# EAGLE design untitled (EAGLE 5.10)
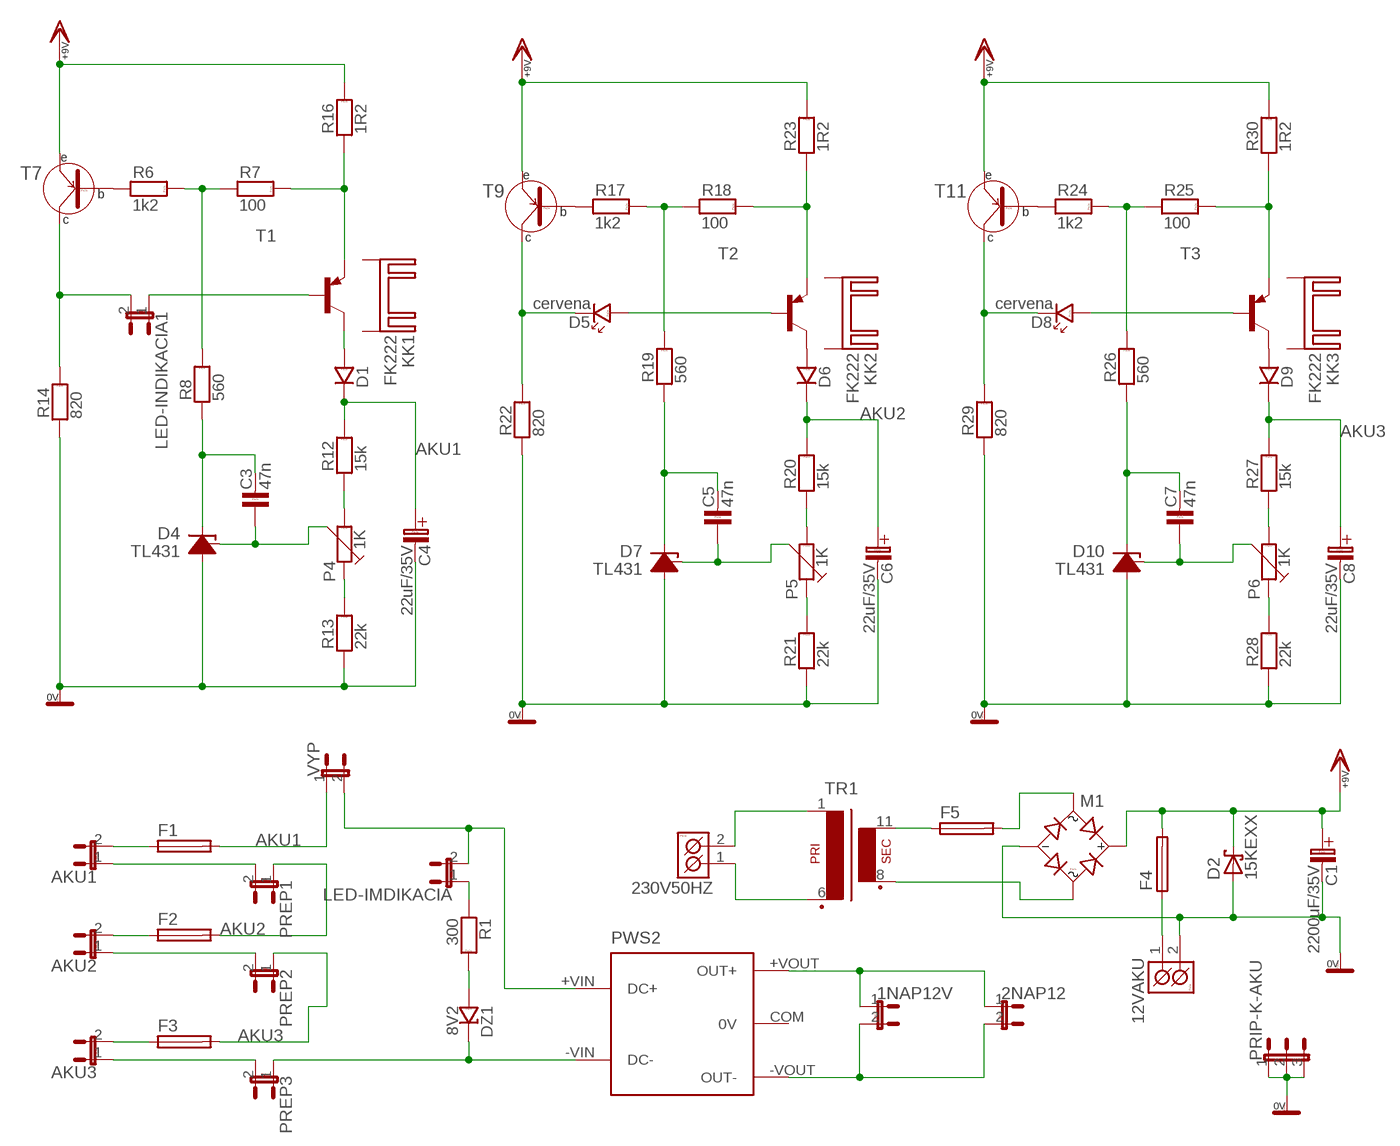
[diagram p0: schematic, sheet 1]

## Parts
1NAP12V  S1G2_JUMP  [S1G2_JUM]
2NAP12  S1G2_JUMP  [S1G2_JUM]
12VAKU  ARK500/2  [ARK500/2]
230V50HZ  ARK500/2  [ARK500/2]
AKU1  S1G2_JUMP  [S1G2_JUM]
AKU2  S1G2_JUMP  [S1G2_JUM]
AKU3  S1G2_JUMP  [S1G2_JUM]
C1  2200uF/35V  C-EL_7,5+  [C-EL7,5+]
C3  47n  C-5  [C-5]
C4  22uF/35V  C-EL_3,5  [C-EL_3,5]
C5  47n  C-5  [C-5]
C6  22uF/35V  C-EL_3,5  [C-EL_3,5]
C7  47n  C-5  [C-5]
C8  22uF/35V  C-EL_3,5  [C-EL_3,5]
D1  1N4148  [D-7,5]
D2  15KEXX  [CB429-17]
D4  TL431  [TO92D-]
D5  cervena  LED_5  [LED_5]
D6  1N4148  [D-7,5]
D7  TL431  [TO92D-]
D8  cervena  LED_5  [LED_5]
D9  1N4148  [D-7,5]
D10  TL431  [TO92D-]
DZ1  8V2  BZX85V  [D-7,5]
F1  SH22,5A  [SH22,5A]
F2  SH22,5A  [SH22,5A]
F3  SH22,5A  [SH22,5A]
F4  SH22,5A  [SH22,5A]
F5  SH22,5A  [SH22,5A]
KK1  FK222  [FK222]
KK2  FK222  [FK222]
KK3  FK222  [FK222]
LED-IMDIKACIA  S1G2_JUMP  [S1G2_JUM]
LED-INDIKACIA1  S1G2_JUMP  [S1G2_JUM]
M1  B250C1500  [DM_WOM]
P4  1K  PT-6H_STO  [PT6H]
P5  1K  PT-6H_STO  [PT6H]
P6  1K  PT-6H_STO  [PT6H]
PREP1  S1G2_JUMP  [S1G2_JUM]
PREP2  S1G2_JUMP  [S1G2_JUM]
PREP3  S1G2_JUMP  [S1G2_JUM]
PRIP-K-AKU  S1G3_JUMP  [S1G3_JUM]
PWS2  TAP2422  [TAP2422]
R1  300  R-5  [R-5]
R6  1k2  R-5  [R-5]
R7  100  R-5  [R-5]
R8  560  R-5  [R-5]
R12  15k  R-5  [R-5]
R13  22k  R-5  [R-5]
R14  820  R-5  [R-5]
R16  1R2  R-7,5  [R-7,5]
R17  1k2  R-5  [R-5]
R18  100  R-5  [R-5]
R19  560  R-5  [R-5]
R20  15k  R-5  [R-5]
R21  22k  R-5  [R-5]
R22  820  R-5  [R-5]
R23  1R2  R-5  [R-5]
R24  1k2  R-5  [R-5]
R25  100  R-5  [R-5]
R26  560  R-5  [R-5]
R27  15k  R-5  [R-5]
R28  22k  R-5  [R-5]
R29  820  R-5  [R-5]
R30  1R2  R-5  [R-5]
T1  -PNP-TO220V  [TO220V]
T2  -PNP-TO220V  [TO220V]
T3  -PNP-TO220V  [TO220V]
T7  BC556  [TO-92]
T9  BC556  [TO-92]
T11  BC556  [TO-92]
TR1  EI48-1  [EI48-1]
VYP  S1G2_JUMP  [S1G2_JUM]

## Nets
0V: 12VAKU.2(K2) C1.C-(C_EL-) C4.C-(C_EL-) C6.C-(C_EL-) C8.C-(C_EL-) D2.A D4.2(A) D7.2(A) D10.2(A) M1.- PRIP-K-AKU.1 PRIP-K-AKU.2 PRIP-K-AKU.3 R13.1 R14.1 R21.1 R22.1 R28.1 R29.1
+9V: C1.C+(C_EL+) D2.C F4.2 M1.+ R16.2 R23.2 R30.2 T7.3(E) T9.3(E) T11.3(E)
AKU1: C4.C+(C_EL+) D1.K F1.2 R12.2 VYP.1
AKU2: C6.C+(C_EL+) D6.K F2.2 PREP1.1 R20.2
AKU3: C8.C+(C_EL+) D9.K F3.2 PREP2.1 R27.2
N$1: LED-IMDIKACIA.1 R1.1
N$2: DZ1.A R1.2
N$3: 230V50HZ.2(K2) TR1.1
N$4: D1.A T1.2(C)
N$5: F5.1 TR1.11(S4)
N$6: F5.2 M1.AC1
N$7: LED-IMDIKACIA.2 PWS2.+VIN(DC+) VYP.2
N$8: AKU1.2 F1.1
N$9: 12VAKU.1(K1) F4.1
N$10: AKU1.1 PREP1.2
N$15: M1.AC2 TR1.8(S3)
N$17: AKU2.2 F2.1
N$18: AKU3.1 PREP3.2
N$19: AKU3.2 F3.1
N$20: D6.A T2.2(C)
N$21: D9.A T3.2(C)
N$22: 1NAP12V.1 2NAP12.1 PWS2.+VOUT(OUT+)
N$23: 230V50HZ.1(K1) TR1.6(P2)
N$24: 1NAP12V.2 2NAP12.2 PWS2.-VOUT(OUT-)
N$28: R6.1 T7.2(B)
N$30: R6.2 R7.1 R8.2
N$31: R7.2 R16.1 T1.3(E)
N$33: C3.2 D4.3(K) R8.1
N$34: LED-INDIKACIA1.1 T1.1(B)
N$35: LED-INDIKACIA1.2 R14.2 T7.1(C)
N$37: C3.1 D4.1(J) P4.3
N$39: P4.1 R13.2
N$40: P4.2 R12.1
N$42: R17.1 T9.2(B)
N$44: DZ1.K PREP3.1 PWS2.-VIN(DC-)
N$46: R17.2 R18.1 R19.2
N$47: R18.2 R23.1 T2.3(E)
N$49: C5.2 D7.3(K) R19.1
N$50: D5.A1(A) T2.1(B)
N$51: D5.K1(K) R22.2 T9.1(C)
N$52: C5.1 D7.1(J) P5.3
N$53: P5.1 R21.2
N$54: P5.2 R20.1
N$55: R24.1 T11.2(B)
N$57: R24.2 R25.1 R26.2
N$58: R25.2 R30.1 T3.3(E)
N$60: C7.2 D10.3(K) R26.1
N$61: D8.A1(A) T3.1(B)
N$62: D8.K1(K) R29.2 T11.1(C)
N$63: C7.1 D10.1(J) P6.3
N$64: P6.1 R28.2
N$65: P6.2 R27.1
NON: AKU2.1 PREP2.2
Unconnected: KK1.A2,8(K) KK1.B2,8(K) KK2.A2,8(K) KK2.B2,8(K) KK3.A2,8(K) KK3.B2,8(K) PWS2.COM(0V)

## Library data of the parts
1NAP12V 2NAP12 AKU1-AKU3 LED-IMDIKACIA LED-INDIKACIA1 PREP1-PREP3 VYP = #PaJa_92:S1G2_JUMP
12VAKU 230V50HZ = #PaJa_92:ARK500/2
C1 = #PaJa_92:C-EL_7,5+
C3 C5 C7 = #PaJa_92:C-5
C4 C6 C8 = #PaJa_92:C-EL_3,5
D1 D6 D9 = #PaJa_92:1N4148
D2 = diode:15KEXX: DIODE
D4 D7 D10 = ads4:TL431: TL431 Adjustable Shunt Regulator
D5 D8 = #PaJa_92:LED_5
DZ1 = #PaJa_92:BZX85V???
F1-F5 = fuse:SH22,5A: FUSE HOLDER grid 22,5mm, isolated cap OGN0031 8201, Schurter (Buerklin)
KK1-KK3 = #heatsink:FK222: HEATSINK manufacturer Fischer/distributor Buerklin
M1 = #PaJa_92:B250C1500
P4-P6 = #PaJa_92:PT-6H_STO
PRIP-K-AKU = #PaJa_92:S1G3_JUMP
PWS2 = traco-electronic:TAP2422: Abgekündigt Ersetzt durch TEN 15 Serie,
R1 R6-R8 R12-R14 R17-R30 = #PaJa_92:R-5
R16 = #PaJa_92:R-7,5
T1-T3 = transistor:*-PNP-: PNP Transistror
T7 T9 T11 = #PaJa_92:BC556
TR1 = trafo:EI48-1: TRANSFORMER 1 primary winding, 1 secondary winding ERA

## Board
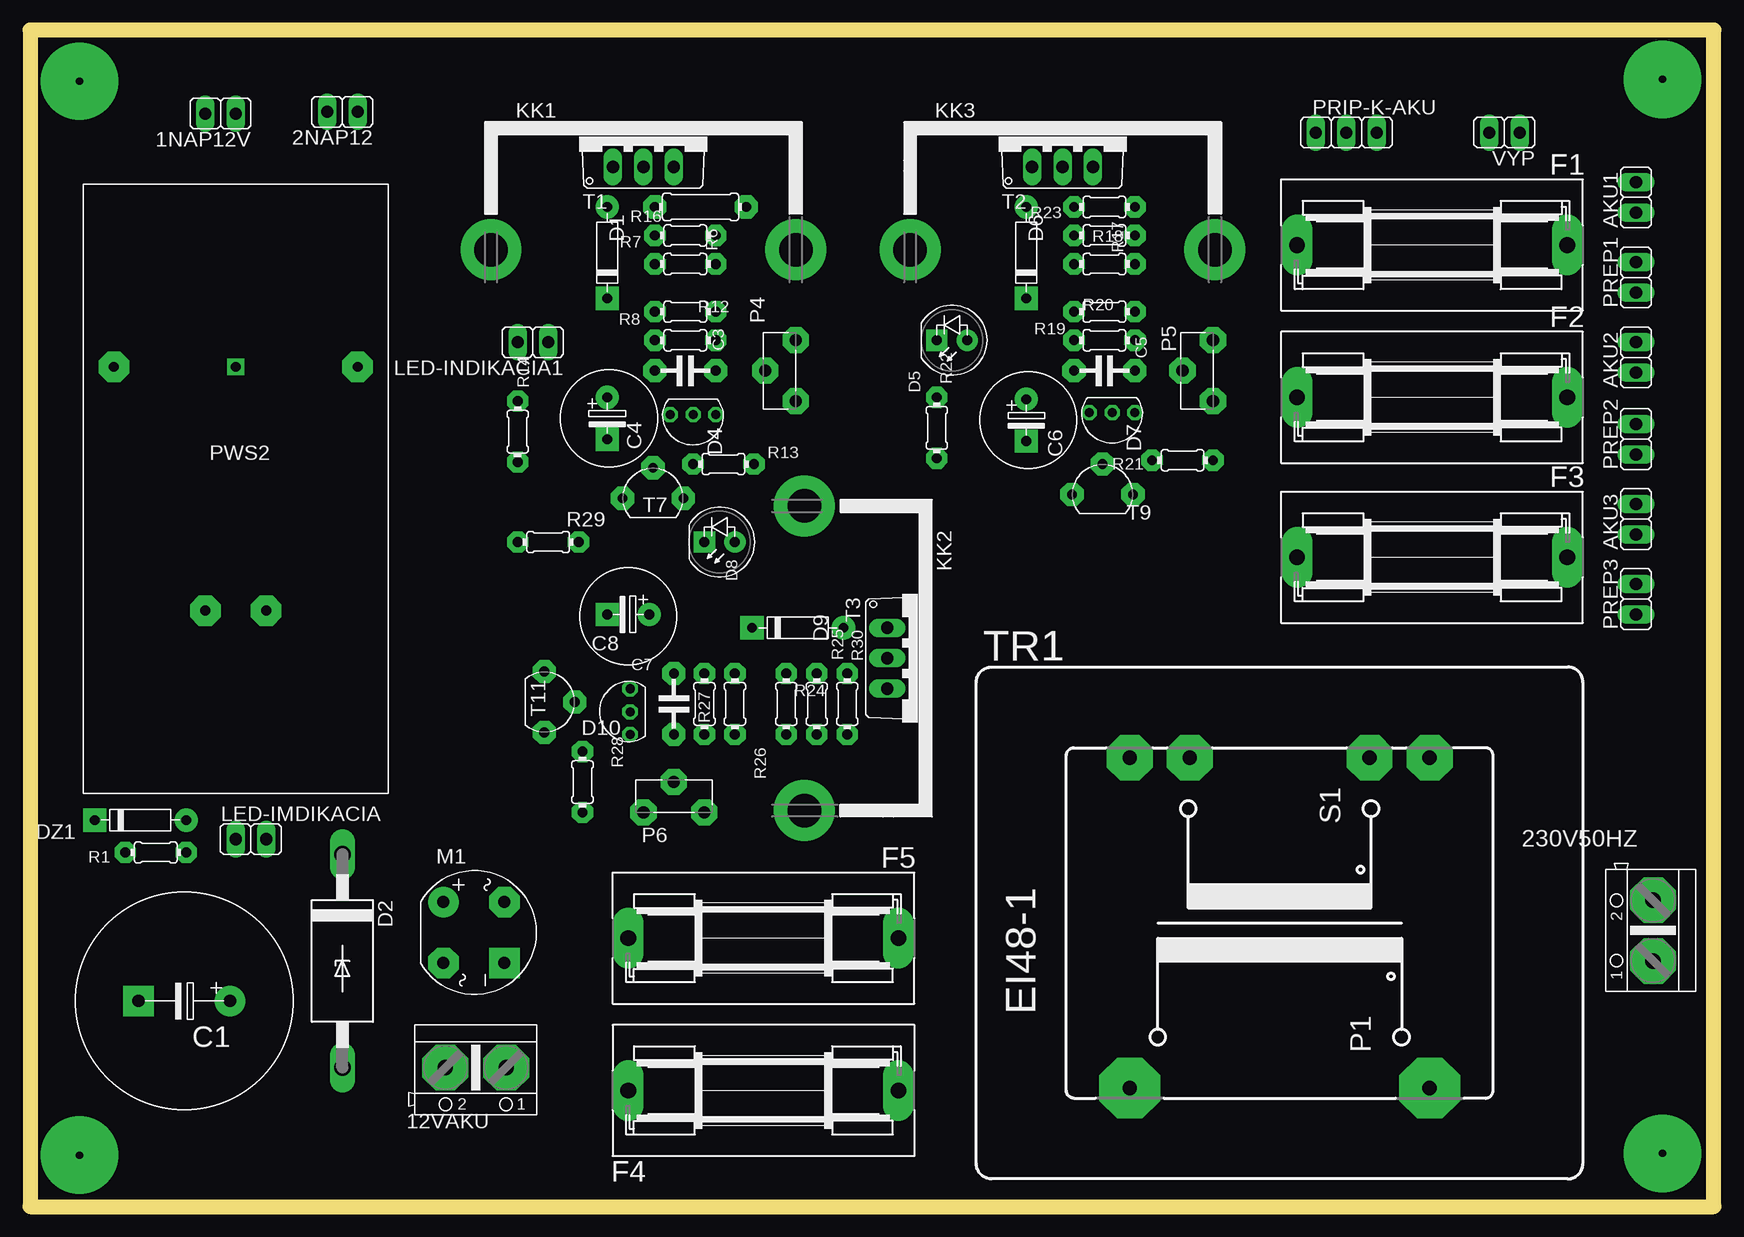
[diagram p1: board, top side]
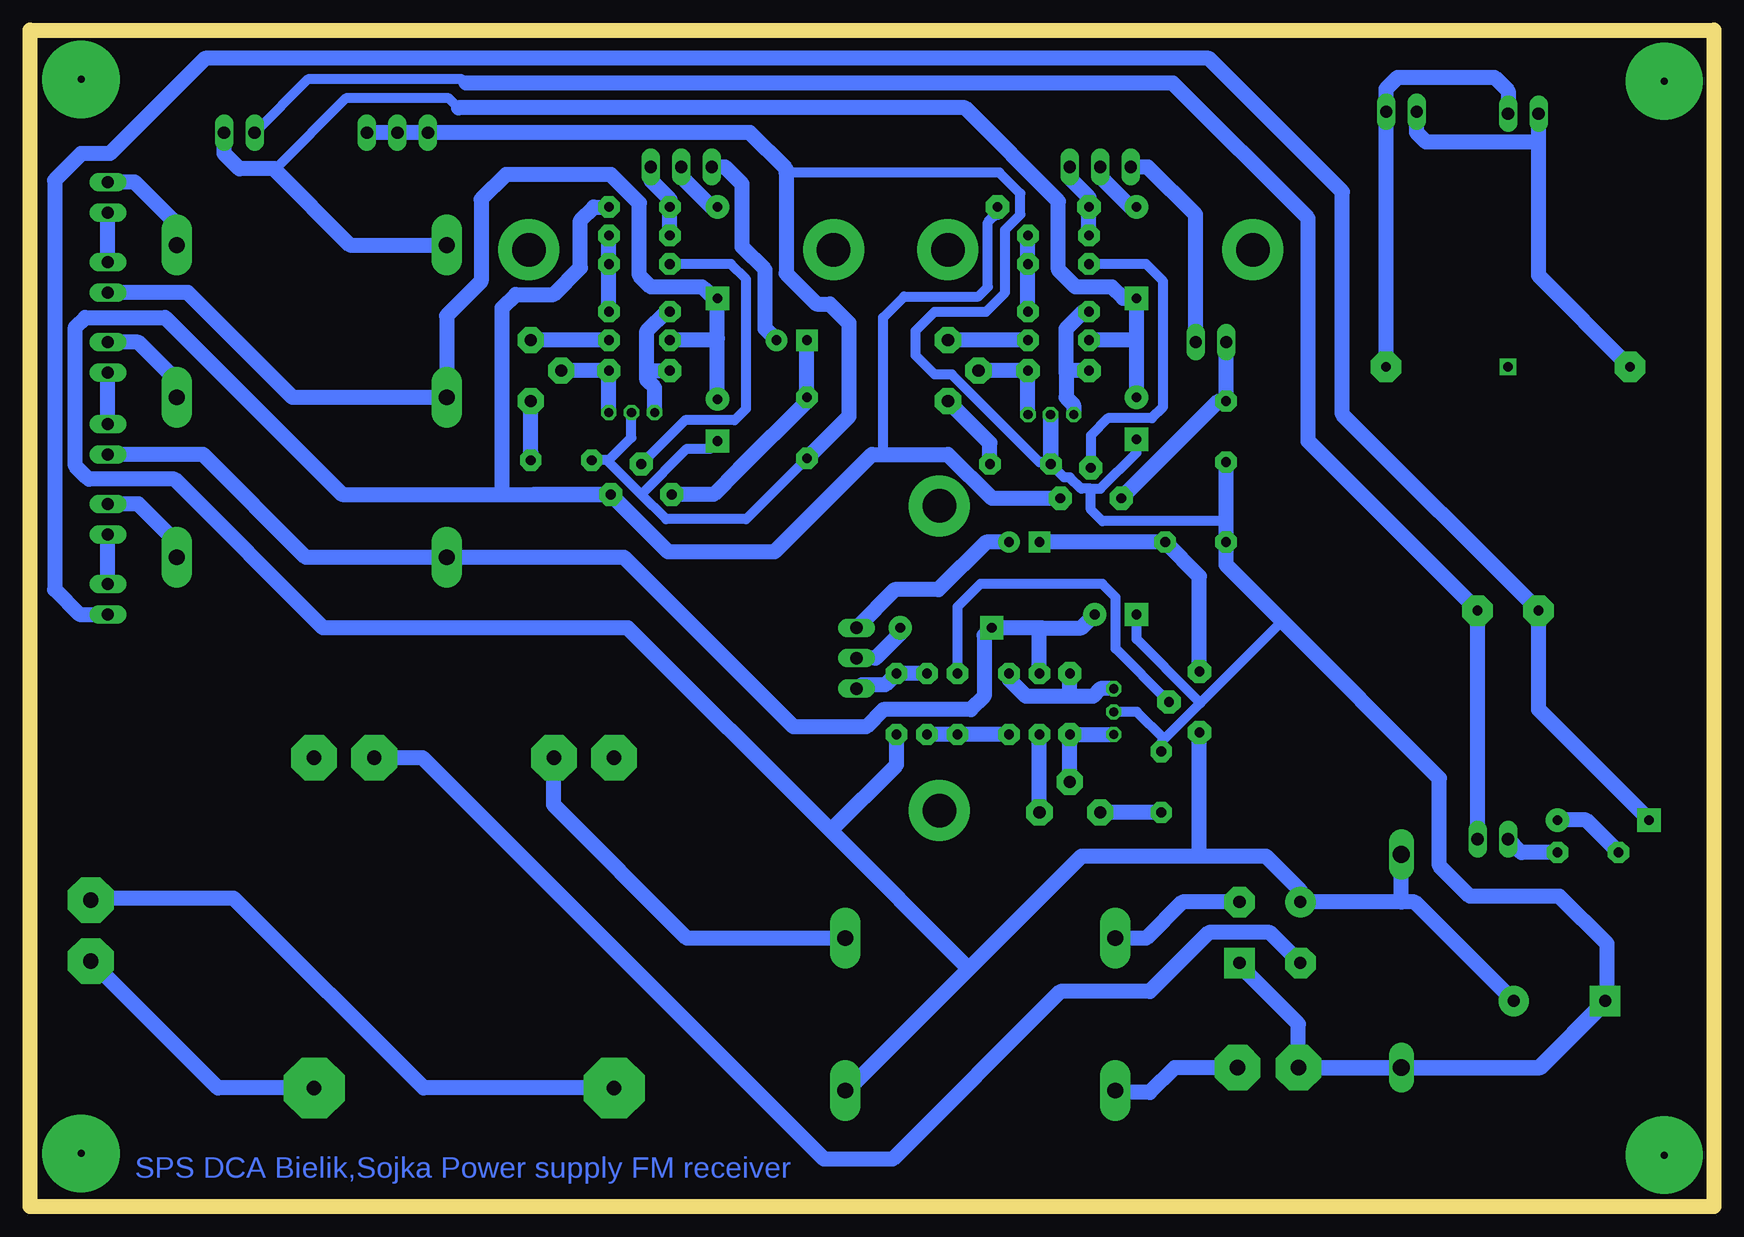
[diagram p2: board, bottom side, seen from below]

Size 140.31 x 98.09 mm. Coordinates in mm from the lower left corner, seen from the top.
Outline: 0,0 140.31,0 140.31,98.09 0,98.09 0,0
Copper layers (1*16): Top 0.035mm / dielectric 1.5mm / Bottom 0.035mm
Design rules "default": minimum track width 10mil, minimum drill 24mil, track to track 8mil, track to pad 8mil, pad to pad 8mil, via to via 8mil, smd to smd 8mil, copper to edge 40mil, drill to drill 8mil, minimum pad ring 10mil, minimum via ring 8mil, stop-mask expansion 4mil, vias tented up to drill 0mil, thermal gap 10mil

### Footprints (pad centres in the part's own frame; a part is rotated, then mirrored left to right if it is on the bottom)
S1G2_JUM = drill 1.016 pad 1.27 long: 1 -1.27,0; 2 1.27,0
ARK500/2 = drill 1.27 pad 3.81 octagon: 1 -2.54,0; 2 2.54,0
C-EL7,5+ = drill 1.016 pad 2.54 round: C+ -3.81,0 | drill 1.016 pad 2.54 square: C- 3.81,0
C-5 = drill 0.813 pad 1.93 octagon: 1 -2.54,0; 2 2.54,0
C-EL_3,5 = drill 0.813 pad 1.93 round: C+ 0,0 | drill 0.813 pad 1.93 square: C- 3.493,0
D-7,5 = drill 0.813 pad 1.93 round: A -3.81,0 | drill 0.813 pad 1.93 square: K 3.81,0
CB429-17 = drill 1.397 long: A 8.89,0; C -8.89,0
TO92D- = drill 0.762 octagon: 1 -1.905,0; 2 -0.025,0; 3 1.905,0
LED_5 = drill 0.813 pad 1.778 round: A1 -1.27,0 | drill 0.813 pad 1.778 square: K1 1.27,0
SH22,5A = drill 1.321 pad 2.54 long: 1 -11.252,0; 2 11.252,0
FK222 = drill 2.794 pad 5.08 round: A2,8 9.601,-12.7; B2,8 9.601,12.7
DM_WOM = drill 1.016 pad 2.54 round: + -2.54,-2.54 | drill 1.016 pad 2.54 square: - 2.54,2.54 | drill 1.016 pad 2.54 octagon: AC1 -2.54,2.54; AC2 2.54,-2.54
PT6H = drill 1.016 pad 2.184 octagon: 1 -2.54,-1.27; 2 2.54,-1.27; 3 0,1.27
S1G3_JUM = drill 1.016 pad 1.27 long: 1 -2.54,0; 2 0,0; 3 2.54,0
TAP2422 = drill 0.813 pad 1.397 square: +VIN 2.54,-10.16; +VOUT 10.16,10.16; -VIN -2.54,-10.16; -VOUT -10.16,10.16; COM 0,10.16
R-5 = drill 0.813 pad 1.778 octagon: 1 -2.54,0; 2 2.54,0
R-7,5 = drill 0.813 pad 1.93 octagon: 1 -3.81,0; 2 3.81,0
TO220V = drill 1.016 long: 1 -2.54,-2.54; 2 0,-2.54; 3 2.54,-2.54
TO-92 = drill 0.813 pad 1.93 octagon: 1 0,2.54; 2 2.54,0; 3 0,-2.54
EI48-1 = drill 1.194 pad 5.08 octagon: 1 -13.767,12.497; 6 -13.767,-12.497 | drill 1.194 pad 3.81 octagon: 7 13.767,-12.497; 8 13.767,-7.493; 11 13.767,7.493; 12 13.767,12.497

### Placement (x,y rotation side)
1NAP12V  15.88,91.12 180 top
2NAP12  26.04,91.28 180 top
12VAKU  37.15,11.59 180 top
230V50HZ  135.25,23.02 90 top
AKU1  133.83,84.14 90 top
AKU2  133.83,70.8 90 top
AKU3  133.83,57.31 90 top
C1  12.86,17.14 180 top
C3  54.61,69.69 180 top
C4  48.1,67.47 270 top
C5  89.53,69.69 180 top
C6  83.03,67.31 270 top
C7  53.66,41.91 90 top
C8  51.59,49.37 180 top
D1  48.1,79.53 270 top
D2  26.04,20.48 270 top
D4  55.25,66.04 180 top
D5  76.84,72.23 180 top
D6  83.03,79.53 270 top
D7  90.17,66.2 180 top
D8  57.47,55.4 180 top
D9  63.98,48.26 180 top
D10  50.01,41.27 90 top
DZ1  9.21,32.23 180 top
F1  116.84,80.17 180 top
F2  116.84,67.47 180 top
F3  116.84,54.13 180 top
F4  61.12,9.68 0 top
F5  61.12,22.38 180 top
KK1  51.12,89.38 270 top
KK2  74.14,45.72 180 top
KK3  86.04,89.38 270 top
LED-IMDIKACIA  18.41,30.64 0 top
LED-INDIKACIA1  41.91,72.07 180 top
M1  36.99,22.86 270 top
P4  62.55,69.69 90 top
P5  97.31,69.69 90 top
P6  53.66,34.13 0 top
PREP1  133.83,77.47 90 top
PREP2  133.83,63.98 90 top
PREP3  133.83,50.64 90 top
PRIP-K-AKU  109.7,89.54 0 top
PWS2  17.14,59.85 0 top
R1  10.48,29.53 180 top
R6  54.61,78.58 0 top
R7  54.61,80.96 180 top
R8  54.61,74.61 0 top
R12  54.61,72.23 180 top
R13  57.78,61.91 0 top
R14  40.64,64.61 90 top
R16  55.88,83.34 0 top
R17  89.53,78.58 0 top
R18  89.54,80.96 180 top
R19  89.54,74.61 0 top
R20  89.54,72.23 180 top
R21  96.04,62.23 0 top
R22  75.56,64.93 90 top
R23  89.54,83.34 0 top
R24  63.02,41.91 270 top
R25  65.56,41.91 90 top
R26  58.74,41.91 270 top
R27  56.2,41.91 90 top
R28  46.04,35.4 270 top
R29  43.18,55.4 0 top
R30  68.1,41.91 270 top
T1  51.12,89.22 0 top
T2  86.04,89.22 0 top
T3  73.98,45.72 270 top
T7  51.91,59.05 90 top
T9  89.38,59.37 90 top
T11  42.86,42.07 0 top
TR1  104.14,23.65 90 top
VYP  122.87,89.54 180 top

### Tracks (layer width: path | path; a pad name or v marks a point on that pad's centre or on a via)
0V
  Bottom 0.813: R22.1 80.64,57.31 87.31,57.31 89.38,59.37 | C8.C- 48.1,47.31 43.34,42.55 | 77.31,86.2 59.53,86.2 57.78,84.45 57.78,82.71 59.05,81.44 59.05,76.2 60.64,74.61 64.93,74.61 66.52,73.03 66.52,70.96 64.93,69.37 63.5,69.37 56.2,62.07 55.24,62.07 | C6.C- 83.66,63.18 85.57,63.18 89.38,59.37 | C4.C- 48.1,62.87 51.12,59.85 51.91,59.85 | 51.91,59.85 52.7,59.85 53.66,60.8 54.13,60.8 R13.1 | 51.91,59.85 51.91,58.1 50.96,57.15 40.64,57.15 | R28.1 46.04,38.73 45.8,38.97 | 42.78,41.99 45.8,38.97 | D10.2 48.08,41.25 45.8,38.97 | 43.34,42.55 | 42.78,41.99 43.34,42.55 | 35.96,48.82 42.78,41.99 | 89.38,59.37 92.15,62.15 | 92.15,62.15 92.23,62.23 R21.1 | D7.2 90.19,64.11 92.15,62.15
  Bottom 1.27: C1.C- 14.61,11.59 D2.A | D2.A | D2.A 12VAKU.2 | PRIP-K-AKU.3 PRIP-K-AKU.2 PRIP-K-AKU.1 106.36,89.53 80.33,89.53 77.31,86.52 77.31,86.2 77.31,77.79 74.77,75.25 73.66,75.25 72.07,73.66 72.07,65.88 R22.1 | 12VAKU.2 14.45,11.59 8.89,17.14 8.89,21.91 12.86,25.88 20.32,25.88 22.86,28.42 22.86,35.72 35.96,48.82 40.64,53.5 R29.1 | M1.- 39.53,20.16 34.61,15.24 12VAKU.2 | R13.1 55.27,61.94 D4.2 55.27,62.1 55.24,62.07 | R29.1 40.64,57.15 R14.1 | R29.1
+9V
  Bottom 0.813: 59.69,82.87 60.48,82.07 60.48,76.68 61.28,75.88 67.47,75.88 69.22,74.14 69.22,62.87
  Bottom 1.27: 98.27,59.37 T9.3 87.15,54.61 | R23.2 93.34,83.34 94.46,82.23 94.46,78.26 96.68,76.04 99.85,76.04 100.97,74.93 100.97,59.37 | R23.2 | R30.2 | C1.C+ 24.92,25.4 26.04,25.4 | 26.04,25.4 M1.+ 34.45,26.35 37.31,29.21 42.86,29.21 | D2.C | 26.04,25.4 D2.C | F4.2 72.23,9.68 62.07,19.84 | 87.15,54.61 | 59.69,82.87 R16.2 | T7.3 60.17,59.05 63.82,62.71 69.37,62.71 | 69.37,62.71 70.17,62.71 78.26,54.61 87.15,54.61 | 69.37,62.71 69.22,62.87 | 87.15,54.61 T9.3 100.97,59.37 | 100.97,59.37 114.3,59.37 129.06,74.14 135.73,74.14 136.53,73.34 136.53,61.75 135.57,60.8 | 135.57,60.8 | 135.57,60.8 135.41,60.64 128.27,60.64 115.89,48.26 90.49,48.26 73.58,31.35 | 54.69,27.23 52.7,29.21 42.86,29.21 | 54.69,27.23 62.07,19.84 | T11.3 | 42.86,29.21 T11.3 | 54.69,27.23 | 62.07,19.84 73.58,31.35 | R30.2 68.1,36.83 73.58,31.35
AKU1
  Bottom 0.813: 104.62,91.6 105.41,92.39 113.98,92.39 119.86,86.52
  Bottom 1.27: D1.K | C4.C+ 48.1,72.07 | 48.1,72.07 48.1,72.23 | 48.1,72.23 D1.K | 48.1,72.07 48.26,72.23 R12.2 48.1,72.23 | D1.K | D1.K 49.21,75.72 50.16,76.68 53.18,76.68 54.61,78.11 54.61,83.82 62.39,91.6 104.62,91.6 | VYP.1 124.14,89.06 | VYP.1 | 119.86,86.52 120.02,86.52 | 120.02,86.52 122.87,86.52 124.14,87.79 VYP.1 | F1.2 113.67,80.17 120.02,86.52
AKU2
  Bottom 1.27: PREP1.1 127.16,76.2 118.43,67.47 F2.2 105.59,74.28 102.71,77.15 102.71,83.98 100.65,86.04 91.92,86.04 | D6.K | C6.C+ 83.03,72.39 | 83.03,72.39 D6.K | D6.K 83.34,75.72 84.14,76.52 | 84.14,76.52 | 84.14,76.52 84.3,76.68 88.58,76.68 89.53,77.63 89.53,83.66 91.92,86.04 | R20.2 83.19,72.23 83.03,72.39 | 91.92,86.04
AKU3
  Bottom 1.27: PREP2.1 125.89,62.71 117.32,54.13 F3.2 90.81,54.13 76.68,40.01 70.64,40.01 69.22,41.43 61.91,41.43 60.8,42.55 60.8,47.62 D9.K 56.04,48.26 | PREP2.1 | 56.04,48.26 52.7,48.26 C8.C+ | R27.2 56.2,48.1 56.04,48.26
KOOO  (via drill 0.6 pad 2.54)
  other vias: 27.3,70.01
N$1
  Bottom 1.27: LED-IMDIKACIA.1 16.03,29.53 R1.1
N$2
  Bottom 1.27: R1.2 10.64,32.23 DZ1.A
N$3
  Bottom 1.27: TR1.1 107.52,9.89 123.35,25.72 135.1,25.72 230V50HZ.2
N$4
  Bottom 1.27: D1.A 48.58,83.34 51.12,85.88 T1.2
N$5
  Bottom 1.27: F5.1 85.57,22.38 96.68,33.5 96.68,37.39 TR1.11
N$6
  Bottom 1.27: M1.AC1 44.29,25.4 47.31,22.38 F5.2
N$7
  Bottom 0.813: 103.98,93.66 104.3,93.98 117.16,93.98 VYP.2
  Bottom 1.27: PWS2.+VIN | LED-IMDIKACIA.2 PWS2.+VIN | 103.98,93.66 45.09,93.66 33.81,82.39 33.81,63.82 PWS2.+VIN
N$8
  Bottom 1.27: F1.1 128.09,81.9 131.6,85.41 AKU1.2 | AKU1.2
N$9
  Bottom 1.27: 12VAKU.1 44.93,11.59 46.99,9.53 49.71,9.53 F4.1
N$10
  Bottom 1.27: PREP1.2 AKU1.1 | PREP1.2
N$12  (via drill 0.6 pad 6.45)
  other vias: 4.13,4.29
N$13  (via drill 0.6 pad 6.45)
  other vias: 4.13,93.82
N$14  (via drill 0.6 pad 6.45)
  other vias: 136.05,4.45
N$15
  Bottom 1.27: M1.AC2 36.99,22.86 42.07,22.86 46.99,17.94 54.45,17.94 68.42,3.97 74.14,3.97 107.59,37.42 TR1.8
N$16  (via drill 0.6 pad 2.54)
  other vias: 14.61,49.69
N$17
  Bottom 1.27: F2.1 128.09,68.88 131.29,72.07 AKU2.2
N$18
  Bottom 1.27: PREP3.2 AKU3.1 | PREP3.2
N$19
  Bottom 1.27: F3.1 128.09,55.38 131.29,58.58 AKU3.2
N$20
  Bottom 1.27: D6.A 83.5,83.34 86.04,85.88 T2.2
N$21
  Bottom 1.27: D9.A 67.79,47.78 69.85,45.72 T3.2
N$22
  Bottom 1.27: PWS2.+VOUT 2NAP12.1 27.3,93.19 26.35,94.14 18.26,94.14 17.14,93.03 1NAP12V.1
N$23
  Bottom 1.27: TR1.6 124.66,9.89 230V50HZ.1
N$24
  Bottom 1.27: 14.61,88.58 14.61,77.63 PWS2.-VOUT | 14.61,88.58 1NAP12V.2 | 2NAP12.2 24.77,89.53 23.97,88.74 14.76,88.74 14.61,88.58
N$25  (via drill 0.6 pad 2.54)
  other vias: 6.99,70.01
N$26  (via drill 0.6 pad 2.54)
  other vias: 19.68,49.69
N$28
  Bottom 0.813: R6.1 47.31,78.58 45.88,77.15 45.88,66.67 46.83,65.72 50.48,65.72 51.91,64.29 T7.2
N$30
  Bottom 1.27: R7.1 | R6.2 R7.1 | R6.2 | R8.2 R6.2
N$31
  Bottom 1.27: R7.2 R16.1 52.07,84.14 53.66,85.72 T1.3
N$33
  Bottom 1.27: R8.1 52.55,74.61 53.82,73.34 53.98,73.18 53.98,69.53 | 53.98,69.53 53.98,67.47 53.34,66.83 D4.3 | C3.2 53.66,69.69 53.98,69.53
N$34
  Bottom 1.27: LED-INDIKACIA1.1 43.18,82.71 47.15,86.68 T1.1
N$35
  Bottom 1.27: R14.2 LED-INDIKACIA1.2 | R14.2 | R14.2 41.27,67.15 T7.1
N$37
  Bottom 1.27: D4.1 C3.1 P4.3 | D4.1
N$39
  Bottom 1.27: R13.2 60.33,63.66 P4.1
N$40
  Bottom 1.27: R12.1 P4.2
N$42
  Bottom 0.813: T9.2 85.72,65.56 81.6,65.56 80.64,66.52 80.64,77.31 81.92,78.58 R17.1
N$44
  Bottom 1.27: DZ1.K 14.61,41.43 PWS2.-VIN 30.96,66.04 30.96,84.61 42.07,95.73 125.73,95.73 131.6,89.85 133.67,87.79 136.05,87.79 138.27,85.57 138.27,51.44 136.21,49.37 PREP3.1
N$46
  Bottom 1.27: R18.1 R17.2 | R17.2 | R19.2 R17.2
N$47
  Bottom 1.27: R18.2 R23.1 87,83.98 88.58,85.57 T2.3
N$49
  Bottom 1.27: R19.1 87.31,74.61 88.9,73.03 88.9,69.37 | 88.9,69.37 88.9,68.9 88.27,68.26 88.27,67.31 D7.3 | C5.2 88.58,69.69 88.9,69.37
N$50
  Bottom 1.27: T2.1 82.39,86.68 80.96,85.25 80.96,80.01 79.06,78.11 79.06,73.18 D5.A1
N$51
  Bottom 1.27: R22.2 D5.K1 | R22.2 | R22.2 75.56,67.15 81.28,61.44 83.34,59.37 86.68,59.37 T9.1
N$52
  Bottom 1.27: D7.1 C5.1 P5.3
N$53
  Bottom 1.27: P5.1 98.58,62.87 R21.2
N$54
  Bottom 1.27: R20.1 P5.2 | P5.2
N$55
  Bottom 0.813: T11.2 49.85,46.51 49.85,50.8 50.96,51.91 61.12,51.91 63.02,50.01 R24.1
  Bottom 1.27: T11.2 | R24.1
N$57
  Bottom 1.27: R26.2 R24.2 R25.1
N$58
  Bottom 1.27: R25.2 R30.1 69.06,43.5 70.96,43.5 71.28,43.18 T3.3
N$60
  Bottom 1.27: D10.3 51.12,43.18 51.75,42.55 53.82,42.55 | 53.82,42.55 57.31,42.55 58.74,43.97 R26.1 | R26.1 | C7.2 53.66,42.7 53.82,42.55
N$61
  Bottom 1.27: D8.A1 60.64,55.4 64.61,51.44 68.26,51.44 T3.1
N$62
  Bottom 1.27: D8.K1 R29.2 42.86,52.55 T11.1 | D8.K1
N$63
  Bottom 1.27: P6.3 C7.1 D10.1
N$64
  Bottom 1.27: R28.2 P6.1
N$65
  Bottom 1.27: P6.2 R27.1 | P6.2
N$1112  (via drill 0.6 pad 6.45)
  other vias: 136.05,93.98
NON
  Bottom 1.27: PREP2.2 AKU2.1

### Text on the board
Bottom: SPS DCA Bielik,Sojka Power supply FM receiver